# Altium schematic sheet Sheet1.SchDoc
size A4
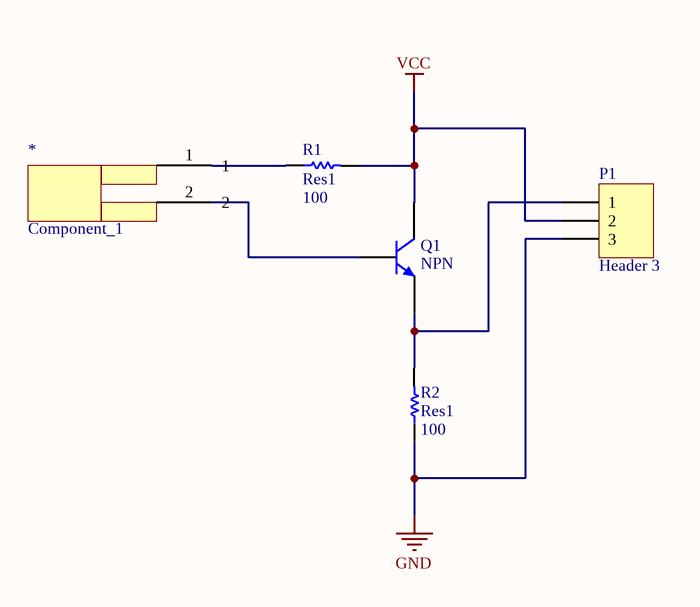
[diagram p0: Sheet1.SchDoc]

## Parts
*  Component_1  [LED]
P1  Header 3  [sh-2.0]
Q1  NPN  [SOT23_M]
R1  Res1  value 100  [1608[0603]]
R2  Res1  value 100  [1608[0603]]

## Nets
GND: P1.3 R2.1
VCC: P1.2 Q1.1(C) R1.2
NetP1_1: P1.1 Q1.3(E) R2.2

Not connected (* = marked no-connect by the designer): * 1 2; Q1 2(B); R1 1

## Library data of the parts
P1 = Header 3: Header, 3-Pin; LatestRevisionDate: 17-Jul-2002; LatestRevisionNote: Re-released for DXP Platform.; Publisher: Altium Limited
Q1 = NPN: NPN Bipolar Transistor; Published: 8-Jun-2000; LatestRevisionDate: 17-Jul-2002; LatestRevisionNote: Re-released for DXP Platform.; PackageReference: TO-226-AA; Publisher: Altium Limited; PackageDescription: TO, Flat Index; 3 In-Line, Axial Leads; Body Dia. 4.8mm; Leads 0.55 x 0.51 mm (max); Code_JEDEC: TO-226-AA
R1 R2 = Res1: Resistor; Published: 8-Jun-2000; LatestRevisionDate: 17-Jul-2002; LatestRevisionNote: Re-released for DXP Platform.; PackageReference: AXIAL-0.3; Publisher: Altium Limited; PackageDescription: Axial Device, Thru-Hole; 2 Leads; 0.3 in Pin Spacing